# Altium schematic sheet stm32f103cbt6.SchDoc
size A3
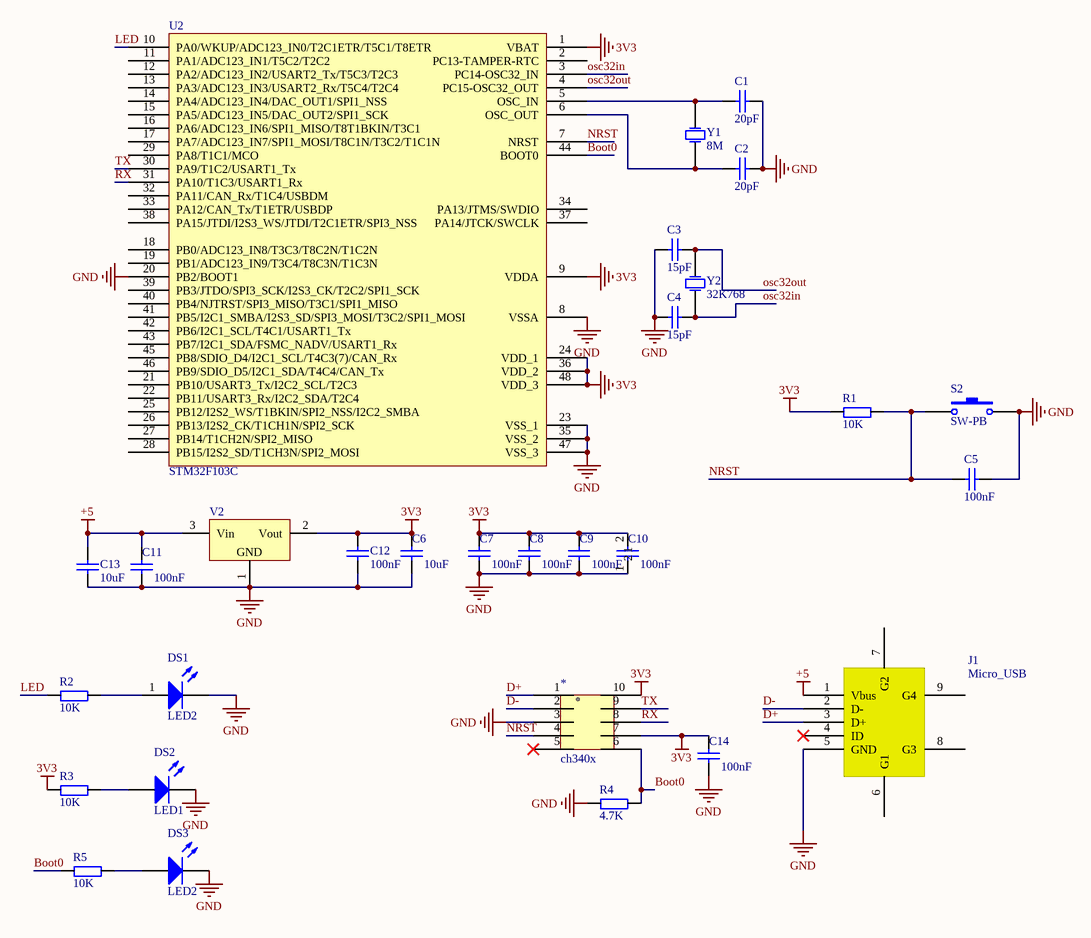
[diagram p0: stm32f103cbt6.SchDoc]

## Parts
*  ch340x  [MSOP-10_L3.0-W3.0-P0.50-LS5.0-BL]
C1  20pF  [C0603]
C2  20pF  [C0603]
C3  15pF  [C0603]
C4  15pF  [C0603]
C5  100nF  [C0603]
C6  10uF  [C0603]
C7  100nF  [C0603]
C8  100nF  [C0603]
C9  100nF  [C0603]
C10  100nF  [C0603]
C11  100nF  [C0603]
C12  100nF  [C0603]
C13  10uF  [C0603]
C14  100nF  [C0603]
DS1  LED2  [SMDLED]
DS2  LED1  [SMDLED]
DS3  LED2  [SMDLED]
J1  Micro_USB  [MICRO-USB-SMD_MICROQTJ]
R1  10K  [0603P]
R2  10K  [0603P]
R3  10K  [0603P]
R4  4.7K  [0603P]
R5  10K  [0603P]
S2  SW-PB  [KEY-SMD_L3.9-W3.0-LS5.0]
U2  STM32F103C  [LQFP-48_M]
V2  AMS1117-3V3  [SOT223_L]  (value not drawn)
Y1  8M  [XTAL(5032)]
Y2  32K768  [CRYSTAL-SMD_L3.2-W1.5-1]

## Nets
3V3: *.7(VCC) *.10(V3) C6.2 C7.2 C8.2 C9.2 C10.2 C12.2 C14.2 R1.1 R3.1 U2.1(VBAT) U2.9(VDDA) U2.24(VDD_1) U2.36(VDD_2) U2.48(VDD_3) V2.2(Vout)
+5: C11.2 C13.2 J1.1(Vbus) V2.3(Vin)
GND: *.3(GND) C1.2 C2.2 C3.1 C4.1 C5.2 C6.1 C7.1 C8.1 C9.1 C10.1 C11.1 C12.1 C13.1 C14.1 DS1.2(K) DS2.2(K) DS3.2(K) J1.5(GND) R4.1 S2.2 U2.8(VSSA) U2.20(PB2/BOOT1) U2.23(VSS_1) U2.35(VSS_2) U2.47(VSS_3) V2.1(GND)
Boot0: *.6(DTR#) R4.2 R5.1 U2.44(BOOT0)
D+: *.1(UD+) J1.3(D+)
D-: *.2(UD-) J1.2(D-)
LED: R2.1 U2.10(PA0/WKUP/ADC123_IN0/T2C1ETR/T5C1/T8ETR)
NRST: *.4(RTS#) C5.1 R1.2 S2.1 U2.7(NRST)
osc32in: C4.2 U2.3(PC14-OSC32_IN) Y2.1(OSC1)
osc32out: C3.2 U2.4(PC15-OSC32_OUT) Y2.2(OSC2)
RX: *.8(TXD) U2.31(PA10/T1C3/USART1_Rx)
TX: *.9(RXD) U2.30(PA9/T1C2/USART1_Tx)
NetC1_1: C1.1 U2.5(OSC_IN) Y1.2(OSC2)
NetC2_1: C2.1 U2.6(OSC_OUT) Y1.1(OSC1)
NetDS1_1: DS1.1(A) R2.2
NetDS2_1: DS2.1(A) R3.2
NetDS3_1: DS3.1(A) R5.2

Not connected (* = marked no-connect by the designer): * 5(CTS#)*; J1 4(ID)* 6(G1) 7(G2) 8(G3) 9(G4); U2 2(PC13-TAMPER-RTC) 11(PA1/ADC123_IN1/T5C2/T2C2) 12(PA2/ADC123_IN2/USART2_Tx/T5C3/T2C3) 13(PA3/ADC123_IN3/USART2_Rx/T5C4/T2C4) 14(PA4/ADC123_IN4/DAC_OUT1/SPI1_NSS) 15(PA5/ADC123_IN5/DAC_OUT2/SPI1_SCK) 16(PA6/ADC123_IN6/SPI1_MISO/T8T1BKIN/T3C1) 17(PA7/ADC123_IN7/SPI1_MOSI/T8C1N/T3C2/T1C1N) 18(PB0/ADC123_IN8/T3C3/T8C2N/T1C2N) 19(PB1/ADC123_IN9/T3C4/T8C3N/T1C3N) 21(PB10/USART3_Tx/I2C2_SCL/T2C3) 22(PB11/USART3_Rx/I2C2_SDA/T2C4) 25(PB12/I2S2_WS/T1BKIN/SPI2_NSS/I2C2_SMBA) 26(PB13/I2S2_CK/T1CH1N/SPI2_SCK) 27(PB14/T1CH2N/SPI2_MISO) 28(PB15/I2S2_SD/T1CH3N/SPI2_MOSI) 29(PA8/T1C1/MCO) 32(PA11/CAN_Rx/T1C4/USBDM) 33(PA12/CAN_Tx/T1ETR/USBDP) 34(PA13/JTMS/SWDIO) 37(PA14/JTCK/SWCLK) 38(PA15/JTDI/I2S3_WS/JTDI/T2C1ETR/SPI3_NSS) 39(PB3/JTDO/SPI3_SCK/I2S3_CK/T2C2/SPI1_SCK) 40(PB4/NJTRST/SPI3_MISO/T3C1/SPI1_MISO) 41(PB5/I2C1_SMBA/I2S3_SD/SPI3_MOSI/T3C2/SPI1_MOSI) 42(PB6/I2C1_SCL/T4C1/USART1_Tx) 43(PB7/I2C1_SDA/FSMC_NADV/USART1_Rx) 45(PB8/SDIO_D4/I2C1_SCL/T4C3(7)/CAN_Rx) 46(PB9/SDIO_D5/I2C1_SDA/T4C4/CAN_Tx)

## Library data of the parts
C1-C14 = Cap: Capacitor; Published: 8-Jun-2000; LatestRevisionDate: 17-Jul-2002; LatestRevisionNote: Re-released for DXP Platform.; PackageReference: RAD-0.3; Publisher: Altium Limited; PackageDescription: Radial Cap, Thru-Hole; 2 Leads; 0.3 in Pin Spacing
  C1 C2: Value: 20pF
  C3 C4: Value: 15pF
  C5 C7-C12 C14: Value: 100nF
  C6 C13: Value: 10uF
DS1-DS3 = LED2: Typical RED, GREEN, YELLOW, AMBER GaAs LED; Published: 8-Jun-2000; LatestRevisionDate: 17-Jul-2002; LatestRevisionNote: Re-released for DXP Platform.; PackageDocument: Feb-2002; PackageReference: 3.2X1.6X1.1; Publisher: Altium Limited
R1-R5 = R
S2 = SW-PB: Switch; Published: 24-Mar-1999; LatestRevisionDate: 17-Jul-2002; LatestRevisionNote: Re-released for DXP Platform.; PackageReference: SPST-2; Publisher: Altium Limited; PackageDescription: Switch; 2 Leads
U2 = STM32F103C: STM32单片机48引脚
V2 = AMS1117: 三端稳压芯片; BOM名称: 稳压芯片; 版权归属: 源创客; 学习资源: www.ooocke.com
Y1 Y2 = XTAL: Crystal Oscillator; Published: 8-Jun-2000; LatestRevisionDate: 17-Jul-2002; LatestRevisionNote: Re-released for DXP Platform.; PackageReference: R38; Publisher: Altium Limited; PackageDescription: Crystal, Thru-Hole; 2 Leads; Body 3.1 x 8.2 mm (Dia.xH)